# EAGLE design LDAQ-MOD-DAC4 (EAGLE 6.6.0)
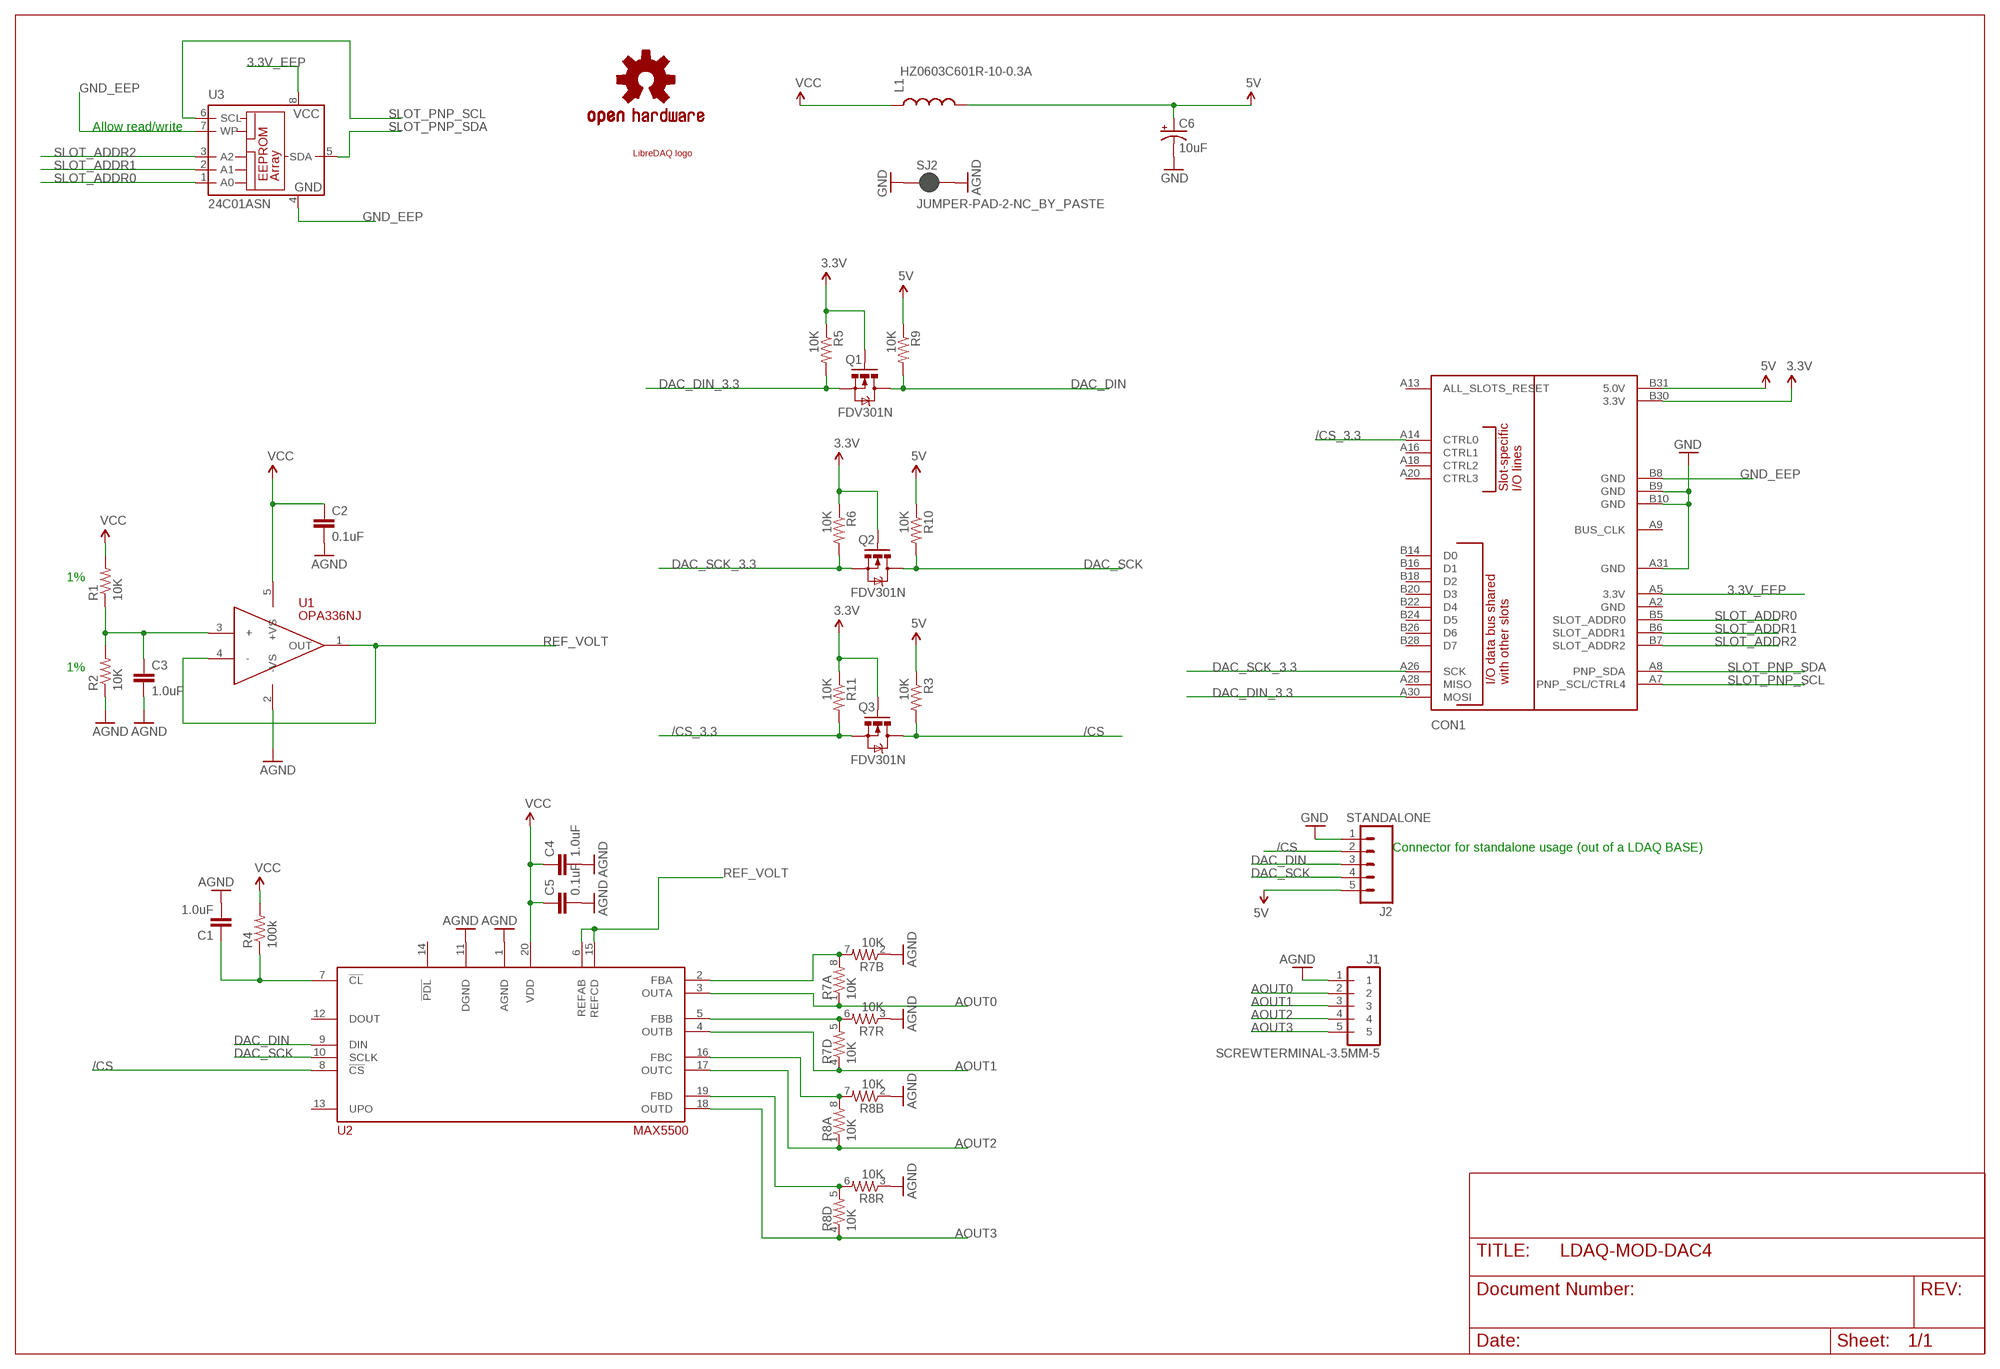
[diagram p0: schematic, sheet 1]

## Parts
C1  1.0uF  1.0UF-16V-10%(0603)  [0603-CAP]
C2  0.1uF  0.1UF-25V(+80/-20%)(0603)  [0603-CAP]
C3  1.0uF  1.0UF-16V-10%(0603)  [0603-CAP]
C4  1.0uF  1.0UF-16V-10%(0603)  [0603-CAP]
C5  0.1uF  0.1UF-25V(+80/-20%)(0603)  [0603-CAP]
C6  10uF  CAP_POL1206  [EIA3216]
CON1  BOARD  LIBREDAQ_DAUGHTER_BOARDPCIE-64-SIZE2-PADS  [PCI-E_64_EDGE_63X50_PADS-ONLY]
J1  SCREWTERMINAL-3.5MM-5  [SCREWTERMINAL-3.5MM-5]
J2  STANDALONE  M05LOCK  [1X05_LOCK]
L1  HZ0603C601R-10-0.3A  INDUCTOR0603  [0603]
LOGO1  OSHW-LOGOL  [OSHW-LOGO-L]
Q1  FDV301N  MOSFET-NCHANNELSMD  [SOT23-3]
Q2  FDV301N  MOSFET-NCHANNELSMD  [SOT23-3]
Q3  FDV301N  MOSFET-NCHANNELSMD  [SOT23-3]
R1  10K  10KOHM-1/10W-1%(0603)0603  [0603-RES]
R2  10K  10KOHM-1/10W-1%(0603)0603  [0603-RES]
R3  10K  RESISTOR0603-RES  [0603-RES]
R4  100k  100KOHM-1/10W-1%(0603)  [0603-RES]
R5  10K  RESISTOR0603-RES  [0603-RES]
R6  10K  RESISTOR0603-RES  [0603-RES]
R7  10K  RESISTOR-ARRAY0603-ARV  [0603-ARV]
R8  10K  RESISTOR-ARRAY0603-ARV  [0603-ARV]
R9  10K  RESISTOR0603-RES  [0603-RES]
R10  10K  RESISTOR0603-RES  [0603-RES]
R11  10K  RESISTOR0603-RES  [0603-RES]
SJ2  JUMPER-PAD-2-NC_BY_PASTE  [PAD-JUMPER-2-NC_BY_PASTE_YES_SILK]
U1  OPA336NJ  [SOT23-5]
U2  MAX5500  [SSOP20]
U3  24C01ASN  [SO-08]
U$1  LIBREDAQ_LOGO_MINILOGO_GENERIC  [LIBREDAQ_LOGO]

## Nets
3.3V: CON1.B30(3.3V) Q1.1(G) Q2.1(G) Q3.1(G) R5.1 R6.1 R11.1
3.3V_EEP: CON1.A5(3.3V) U3.8(VCC)
5V: C6.A(+) CON1.B31(5.0V) J2.5 L1.2 R3.1 R9.1 R10.1
/CS: J2.2 Q3.3(D) R3.2 U2.8(!CS)
/CS_3.3: CON1.A14(CTRL0) Q3.2(S) R11.2
AGND: C1.2 C2.2 C3.2 C4.2 C5.2 J1.1 R2.1 R7.2 R7.3 R8.2 R8.3 SJ2.2 U1.2(-VS) U2.1(AGND) U2.11(DGND)
AOUT0: J1.2 R7.1 U2.3(OUTA)
AOUT1: J1.3 R7.4 U2.4(OUTB)
AOUT2: J1.4 R8.1 U2.17(OUTC)
AOUT3: J1.5 R8.4 U2.18(OUTD)
DAC_DIN: J2.3 Q1.3(D) R9.2 U2.9(DIN)
DAC_DIN_3.3: CON1.A30(MOSI) Q1.2(S) R5.2
DAC_SCK: J2.4 Q2.3(D) R10.2 U2.10(SCLK)
DAC_SCK_3.3: CON1.A26(SCK) Q2.2(S) R6.2
GND: C6.C(-) CON1.A31(GND) CON1.B9(GND) CON1.B10(GND) J2.1 SJ2.1
GND_EEP: CON1.B8(GND) U3.4(GND) U3.7(WP)
N$1: R7.7 R7.8 U2.2(FBA)
N$2: C1.1 R4.1 U2.7(!CL)
N$3: R7.5 R7.6 U2.5(FBB)
N$5: R8.7 R8.8 U2.16(FBC)
N$6: R8.5 R8.6 U2.19(FBD)
N$10: C3.1 R1.1 R2.2 U1.3(+)
REF_VOLT: U1.1(OUT) U1.4(-) U2.6(REFAB) U2.15(REFCD)
SLOT_ADDR0: CON1.B5(SLOT_ADDR0) U3.1(A0)
SLOT_ADDR1: CON1.B6(SLOT_ADDR1) U3.2(A1)
SLOT_ADDR2: CON1.B7(SLOT_ADDR2) U3.3(A2)
SLOT_PNP_SCL: CON1.A7(PNP_SCL/CTRL4) U3.6(SCL)
SLOT_PNP_SDA: CON1.A8(PNP_SDA) U3.5(SDA)
VCC: C2.1 C4.1 C5.1 L1.1 R1.2 R4.2 U1.5(+VS) U2.20(VDD)
Unconnected: CON1.A2(GND) CON1.A9(BUS_CLK) CON1.A13(ALL_SLOTS_RESET) CON1.A16(CTRL1) CON1.A18(CTRL2) CON1.A20(CTRL3) CON1.A28(MISO) CON1.B14(D0) CON1.B16(D1) CON1.B18(D2) CON1.B20(D3) CON1.B22(D4) CON1.B24(D5) CON1.B26(D6) CON1.B28(D7) U2.12(DOUT) U2.13(UPO) U2.14(!PDL)

## Notes on the sheet
- Allow read/write
- 1%
- 1%
- Connector for standalone usage (out of a LDAQ BASE)

## Library data of the parts
C1 C3 C4 = SparkFun-Capacitors:1.0UF-16V-10%(0603): CAP-00868; PROD_ID: CAP-00868
C2 C5 = SparkFun-Capacitors:0.1UF-25V(+80/-20%)(0603): CAP-00810 Ceramic Standard decoupling cap; PROD_ID: CAP-00810
C6 = SparkFun-Capacitors:CAP_POL: Capacitor Polarized These are standard SMD and PTH capacitors. Normally 10uF, 47uF, and 100uF in electrolytic and tantalum varieties. Always verify the external diameter of the through hole cap, it varies with capacity, voltage, and manufacturer. The EIA devices should be standard.
CON1 = libredaq-comps:LIBREDAQ_DAUGHTER_BOARD: LibreDAQ Expansion board (PCI-E form)
J1 = libredaq-comps:SCREWTERMINAL-3.5MM-5
J2 = SparkFun-Connectors:M05: Header 5 Standard 5-pin 0.1" header. Use with straight break away headers (SKU : PRT-00116), right angle break away headers (PRT-00553), swiss pins (PRT-00743), machine pins (PRT-00117), and female headers (PRT-00115). Molex polarized connector foot print use with SKU : PRT-08230 with associated crimp pins and housings.
L1 = SparkFun-Passives:INDUCTOR: Inductors Basic Inductor/Choke - 0603 and 1206. Footprints are not proven and vary greatly between part numbers. SRN6045- 33uH, 20% 1.4A SDR0403-560KL - 56uH, 10%, 500mA RMS/740mA peak
LOGO1 = SparkFun-Aesthetics:OSHW-LOGO: Open Source Hardware Logo This logo indicates the piece of hardware it is found on incorporates a OSHW license and/or adheres to the definition of open source hardware found here: http://freedomdefined.org/OSHW
Q1-Q3 = SparkFun:MOSFET-NCHANNEL
R1 R2 = SparkFun-Resistors:10KOHM-1/10W-1%(0603): RES-00824; PROD_ID: RES-00824
R3 R5 R6 R9-R11 = SparkFun:RESISTOR: Resistor Basic schematic elements and footprints for 0603, 1206, and PTH resistors.
R4 = SparkFun-Resistors:100KOHM-1/10W-1%(0603): RES-07828; PROD_ID: RES-07828
R7 R8 = SparkFun-Resistors:RESISTOR-ARRAY: Array Chip Resistor Source: RS Component / Phycomp
SJ2 = SparkFun-Passives:JUMPER-PAD-2-NC_BY_PASTE
U1 = libredaq-comps:OPA336NJ
U2 = libredaq-comps:MAX5500: The MAX5500/MAX5501 integrate four low-power, 12-bit digital-to analog converters (DACs) and four precision output amplifiers in a small, 20-pin package.
U3 = libredaq-comps:24C*: Serial EEPROM 1 K/2 K/4 K; MPN: AT24C01BN-SH-B; OC_FARNELL: 1362638; OC_NEWARK: 50M3313
U$1 = libredaq-comps:LIBREDAQ_LOGO_MINI

## Board
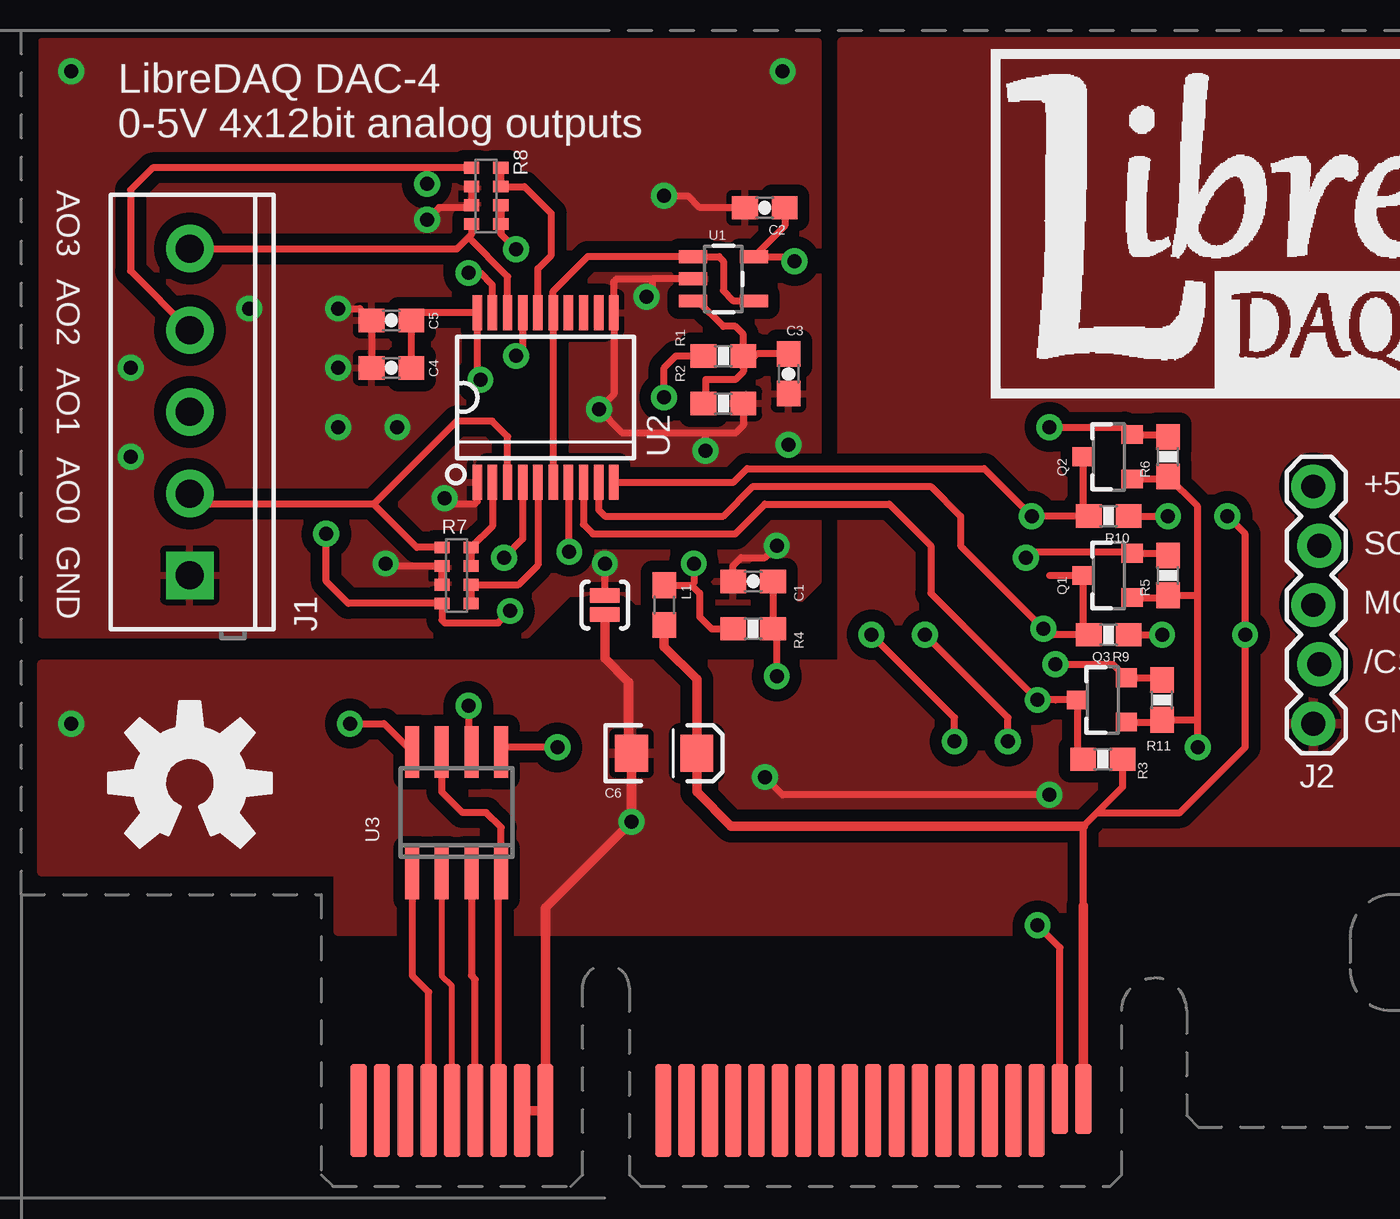
[diagram p1: board, top side]
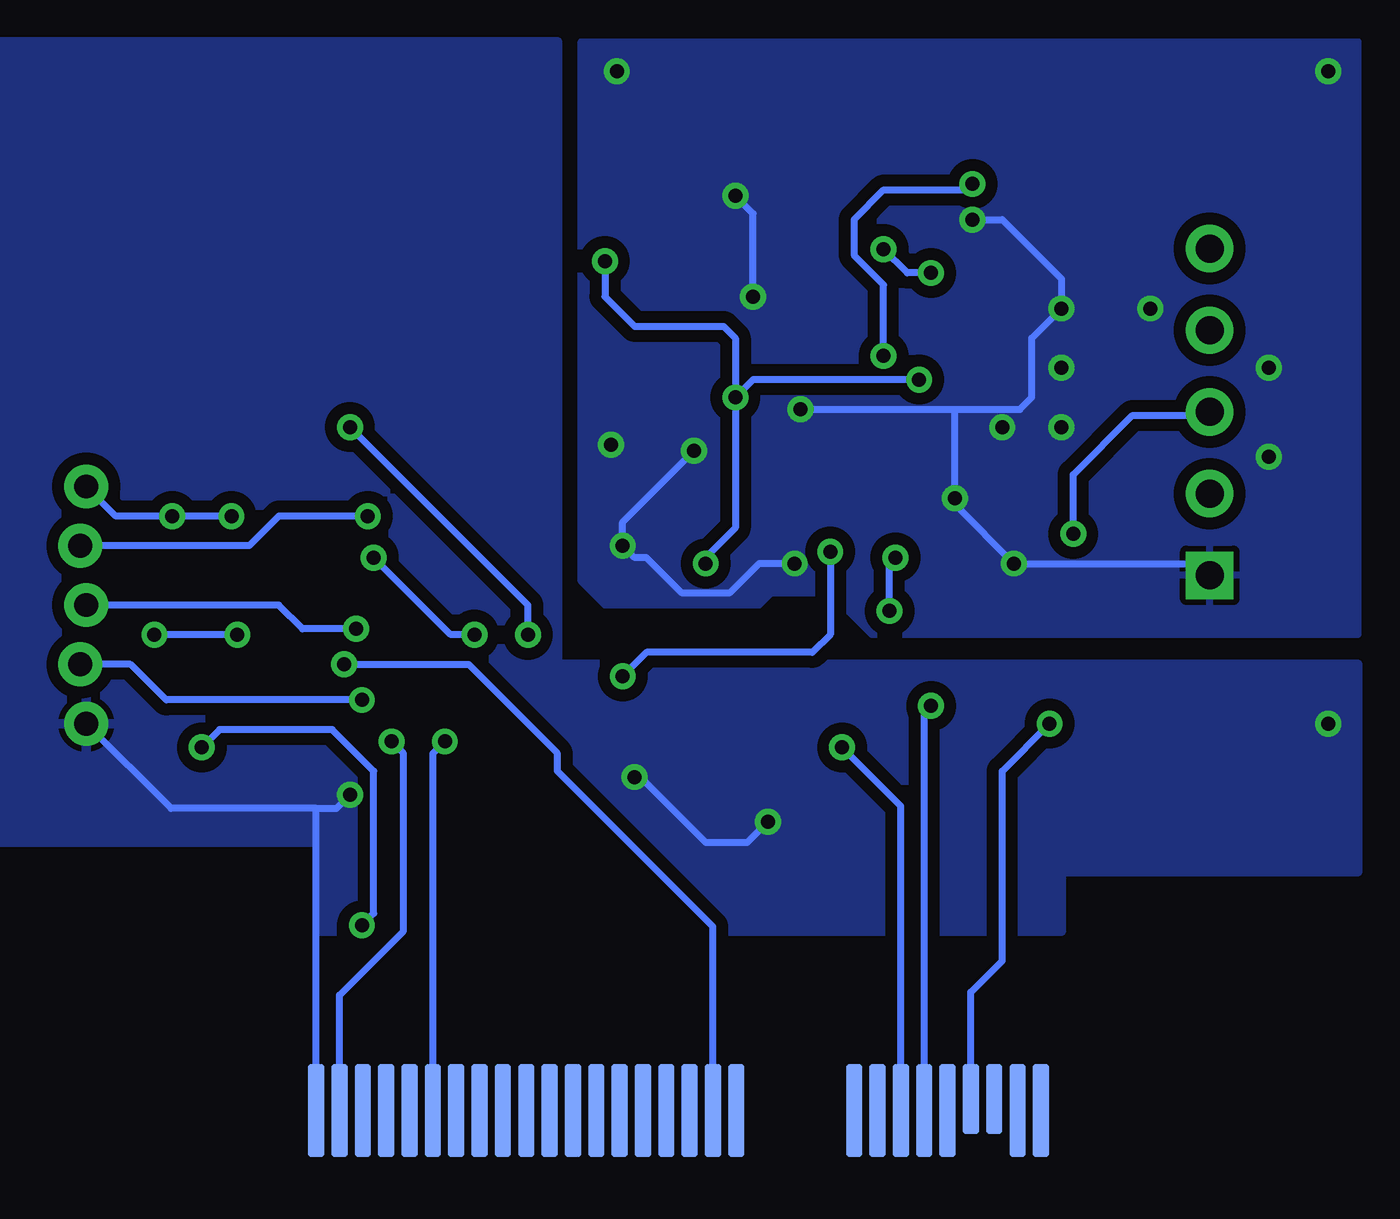
[diagram p2: board, bottom side, seen from below]

No outline drawn. Coordinates in mm, seen from the top.
Copper layers (1*16): Top 0.035mm / dielectric 1.5mm / Bottom 0.035mm
Design rules "LibreDAQ": minimum track width 8mil, minimum drill 20mil, track to track 8mil, track to pad 7mil, pad to pad 7mil, via to via 8mil, smd to smd 7mil, copper to edge 6mil, drill to drill 8mil, minimum pad ring 12mil, minimum via ring 10mil, stop-mask expansion 4mil, vias tented up to drill 25mil, thermal gap 10mil

### Footprints (pad centres in the part's own frame; a part is rotated, then mirrored left to right if it is on the bottom)
0603-CAP = smd 1.1 x 1: 1 -0.85,0; 2 0.85,0
EIA3216 = smd 1.4 x 1.6: A 1.4,0; C -1.4,0
PCI-E_64_EDGE_63X50_PADS-ONLY = smd 0.7 x 4 bottom: A2 -10.55,3.75; A3 -9.55,3.75; A6 -6.55,3.75; A7 -5.55,3.75; A8 -4.55,3.75; A9 -3.55,3.75; A10 -2.55,3.75; A13 2.5,3.75; A14 3.5,3.75; A15 4.5,3.75; A16 5.5,3.75; A17 6.5,3.75; A18 7.5,3.75; A19 8.5,3.75; A20 9.5,3.75; A21 10.5,3.75; A22 11.5,3.75; A23 12.5,3.75; A24 13.5,3.75; A25 14.5,3.75; A26 15.5,3.75; A27 16.5,3.75; A28 17.5,3.75; A29 18.5,3.75; A30 19.5,3.75; A31 20.5,3.75 | smd 0.7 x 3 bottom: A4 -8.55,4.25; A5 -7.55,4.25 | smd 0.7 x 4: B2 -10.55,3.75; B3 -9.55,3.75; B4 -8.55,3.75; B5 -7.55,3.75; B6 -6.55,3.75; B7 -5.55,3.75; B8 -4.55,3.75; B9 -3.55,3.75; B10 -2.55,3.75; B13 2.5,3.75; B14 3.5,3.75; B15 4.5,3.75; B16 5.5,3.75; B17 6.5,3.75; B18 7.5,3.75; B19 8.5,3.75; B20 9.5,3.75; B21 10.5,3.75; B22 11.5,3.75; B23 12.5,3.75; B24 13.5,3.75; B25 14.5,3.75; B26 15.5,3.75; B27 16.5,3.75; B28 17.5,3.75; B29 18.5,3.75 | smd 0.7 x 3: B30 19.5,4.25; B31 20.5,4.25
SCREWTERMINAL-3.5MM-5 = drill 1.2 pad 2.032 square: 1 0,0 | drill 1.2 pad 2.032: 2 3.5,0; 3 7,0; 4 10.5,0; 5 14,0
1X05_LOCK = drill 1.016 pad 1.88: 1 0,0.127; 2 2.54,-0.127; 3 5.08,0.127; 4 7.62,-0.127; 5 10.16,0.127
0603 = smd 1.1 x 1: 1 -0.85,0; 2 0.85,0
SOT23-3 = smd 0.8 x 0.9: 1 -0.95,-1; 2 0.95,-1; 3 0,1.1
0603-RES = smd 1.1 x 1: 1 -0.85,0; 2 0.85,0
0603-ARV = smd 0.5 x 0.65: 1 -1.2,-0.625; 2 -0.4,-0.625; 3 0.4,-0.625; 4 1.2,-0.625; 5 1.2,0.625; 6 0.4,0.625; 7 -0.4,0.625; 8 -1.2,0.625
PAD-JUMPER-2-NC_BY_PASTE_YES_SILK = smd 0.635 x 1.27: 1 -0.401,0; 2 0.413,0
SOT23-5 = smd 0.55 x 1.2: 1 -0.95,-1.3; 2 0,-1.3; 3 0.95,-1.3; 4 0.95,1.3; 5 -0.95,1.3
SSOP20 = smd 0.4 x 1.5: 1 -2.925,-3.625; 2 -2.275,-3.625; 3 -1.625,-3.625; 4 -0.975,-3.625; 5 -0.325,-3.625; 6 0.325,-3.625; 7 0.975,-3.625; 8 1.625,-3.625; 9 2.275,-3.625; 10 2.925,-3.625; 11 2.925,3.625; 12 2.275,3.625; 13 1.625,3.625; 14 0.975,3.625; 15 0.325,3.625; 16 -0.325,3.625; 17 -0.975,3.625; 18 -1.625,3.625; 19 -2.275,3.625; 20 -2.925,3.625
SO-08 = smd 0.6 x 2.2: 1 -1.905,-2.6; 2 -0.635,-2.6; 3 0.635,-2.6; 4 1.905,-2.6; 5 1.905,2.6; 6 0.635,2.6; 7 -0.635,2.6; 8 -1.905,2.6

### Placement (x,y rotation side)
C1  31.75,26.42 180 top
C2  32.26,42.42 180 top
C3  33.27,35.31 270 top
C4  16.26,35.56 180 top
C5  16.26,37.59 180 top
C6  27.94,19.05 0 top
CON1  25.4,0 0 top
J1  7.62,26.67 90 top
J2  55.88,20.32 90 top
L1  27.94,25.4 270 top
LOGO1  7.62,17.78 0 top
Q1  46.99,26.67 90 top
Q2  46.99,31.75 90 top
Q3  46.74,21.34 90 top
R1  30.48,36.07 180 top
R2  30.48,34.04 180 top
R3  46.74,18.8 180 top
R4  31.75,24.38 180 top
R5  49.53,26.67 90 top
R6  49.53,31.75 90 top
R7  19.05,26.67 270 top
R8  20.32,42.93 270 top
R9  46.99,24.13 180 top
R10  46.99,29.21 180 top
R11  49.28,21.34 90 top
SJ2  25.4,25.4 90 top
U1  30.48,39.37 270 top
U2  22.86,34.29 0 top
U3  19.05,16.51 0 top
U$1  41.91,34.29 0 top

### Tracks (layer width: path | path; a pad name or v marks a point on that pad's centre or on a via)
3.3V  (via drill 0.6)
  Top 0.305: Q3.1 49.18,20.39 R11.1 50.71,20.49 50.8,20.57 | Q1.1 49.43,25.72 R5.1 50.71,25.82 50.8,25.91 | Q2.1 49.43,30.8 R6.1 50.8,29.63 50.8,25.91 | CON1.B30 44.9,10.73 v43.94,11.68 | v50.8,19.3 50.8,20.57 | 50.8,20.57 50.8,25.91
  Bottom 0.305: v43.94,11.68 43.43,12.19 43.43,18.29 45.21,20.07 50.04,20.07 v50.8,19.3
3.3V_EEP  (via drill 0.6)
  Top 0.305: v14.48,20.32 15.94,20.32 U3.8
  Bottom 0.305: CON1.A5 17.85,8.82 16.51,10.16 16.51,18.29 v14.48,20.32
5V  (via drill 0.6)
  Top 0.305: 45.9,12.52 45.9,15.93 46.48,16.51 | 46.48,16.51 47.59,17.61 R3.1 47.5,18.71 | R10.1 v49.53,29.21 | 46.48,16.51 50.04,16.51 52.83,19.3 v52.83,24.13 52.83,28.45 v52.07,29.21 | R9.1 v49.28,24.13
  Top 0.406: CON1.B31 45.9,12.52 | L1.2 27.94,23.62 29.34,22.22 C6.A 29.34,17.4 30.81,15.93 45.9,15.93
  Bottom 0.305: v49.53,29.21 v52.07,29.21 54.48,29.21 J2.5 | v49.28,24.13 v52.83,24.13
/CS  (via drill 0.6)
  Top 0.305: U2.8 24.48,28.86 24.89,28.45 30.99,28.45 32.26,29.72 37.59,29.72 39.37,27.94 39.37,25.91 v43.94,21.34 Q3.3 | Q3.3 44.7,21.34 | Q3.3 45.64,19.05 R3.2
  Bottom 0.305: v43.94,21.34 52.32,21.34 53.85,22.86 J2.2
/CS_3.3  (via drill 0.6)
  Top 0.305: R11.2 49.18,22.29 Q3.2 47.16,22.86 v44.7,22.86
  Bottom 0.305: CON1.A14 28.9,11.63 35.56,18.29 35.56,19.05 39.37,22.86 v44.7,22.86
AGND  (via drill 0.6)
  Top 0.305: C4.2 C5.2 14.9,38.1 v13.97,38.1 | R7.3 R7.2 16.11,27.07 v16,27.18 | R8.3 R8.2 19.7,42.55 19.56,42.42 18.29,42.42 v17.78,41.91 | R2.1 31.33,33.11 30.99,32.77 29.72,32.77 | 29.72,32.77 26.16,32.77 v25.15,33.78 25.79,34.42 U2.11 25.79,39.25 25.91,39.37 27.43,39.37 | C2.2 29.46,42.42 28.96,42.93 v27.94,42.93 | U1.2 27.43,39.37 | 27.43,39.37 27.43,38.86 v27.18,38.61 | U2.1 19.93,29.84 19.81,29.72 18.8,29.72 v18.54,29.97 | C1.2 30.9,27.09 31.24,27.43 32.26,27.43 v32.77,27.94 | v29.72,32 29.72,32.77 | SJ2.2 v25.4,27.18
  Bottom 0.305: J1.1 8.13,27.18 v16,27.18 18.54,29.72 v18.54,29.97 18.54,33.78 | v25.15,33.78 18.54,33.78 | 18.54,33.78 15.75,33.78 15.24,34.29 15.24,36.83 v13.97,38.1 13.97,39.37 16.51,41.91 v17.78,41.91 | v27.18,38.61 27.18,42.16 v27.94,42.93 | v29.72,32 32.77,28.96 v32.77,27.94 32.26,27.43 31.75,27.43 30.23,25.91 28.19,25.91 26.92,27.18 v25.4,27.18
  other vias: 5.08,35.56 5.08,31.75 10.16,38.1 2.54,48.26 16.51,33.02 33.27,32.26 13.97,35.56 13.97,33.02 33.02,48.26
  pour Top (isolate 0.508): 1.27,49.53 1.27,24.13 22.1,24.13 23.88,25.91 26.42,25.91 26.92,25.4 33.53,25.4 34.54,26.42 34.54,49.53
  pour Bottom (isolate 0.508): 1.27,49.53 1.27,24.13 22.1,24.13 23.88,25.91 26.42,25.91 26.92,25.4 33.53,25.4 34.54,26.42 34.54,49.53
AOUT0
  Top 0.305: R7.1 17.34,27.87 15.49,29.72 | 15.49,29.72 8.07,29.72 J1.2 | U2.3 21.23,32.61 20.57,33.27 19.05,33.27 15.49,29.72
AOUT1  (via drill 0.6)
  Top 0.305: v13.46,28.45 13.46,26.42 14.41,25.47 R7.4 18.43,24.75 18.54,24.64 20.83,24.64 v21.34,25.15 | U2.4 21.89,28.23 v21.08,27.43
  Bottom 0.305: v13.46,28.45 13.46,30.99 10.92,33.53 7.76,33.53 J1.3 | v21.34,25.15 21.34,27.18 v21.08,27.43
AOUT2  (via drill 0.6)
  Top 0.305: R8.1 17.78,44.13 | 17.78,44.13 6.03,44.13 5.08,43.18 5.08,39.71 J1.4 | U2.17 21.89,36.36 v21.59,36.07 | v17.78,43.43 17.78,44.13
  Bottom 0.305: v21.59,36.07 21.59,39.12 22.86,40.39 22.86,41.91 21.59,43.18 18.03,43.18 v17.78,43.43
AOUT3
  Top 0.305: J1.5 7.65,40.64 19.05,40.64 19.56,41.15 | R8.4 19.7,41.28 19.56,41.15 | U2.18 21.23,39.47 19.56,41.15
DAC_DIN  (via drill 0.6)
  Top 0.305: U2.9 25.14,29.48 25.4,29.21 30.48,29.21 31.75,30.48 39.37,30.48 40.64,29.21 40.64,27.94 v44.2,24.38 | 44.45,26.67 Q1.3 45.89,24.38 R9.2 44.45,24.13 v44.2,24.38 | 43.94,24.13 v44.2,24.38
  Bottom 0.305: J2.3 47.5,25.4 46.48,24.38 v44.2,24.38
DAC_DIN_3.3  (via drill 0.6)
  Top 0.305: R5.2 49.43,27.62 Q1.2 47.92,27.69 43.69,27.69 v43.43,27.43 | v42.67,19.56 42.67,20.57 v39.12,24.13
  Bottom 0.305: CON1.A30 44.9,8.69 42.16,11.43 42.16,19.05 v42.67,19.56 | v39.12,24.13 40.13,24.13 v43.43,27.43
DAC_SCK  (via drill 0.6)
  Top 0.305: U2.10 30.92,30.66 31.5,31.24 41.66,31.24 v43.69,29.21 R10.2 45.89,29.46 Q2.3
  Bottom 0.305: v43.69,29.21 47.5,29.21 48.77,27.94 J2.4
DAC_SCK_3.3  (via drill 0.6)
  Top 0.305: R6.2 49.43,32.7 Q2.2 47.67,33.02 v44.45,33.02 | v40.39,19.56 40.39,20.57 v36.83,24.13
  Bottom 0.305: CON1.A26 40.9,19.04 v40.39,19.56 | v36.83,24.13 36.83,25.4 v44.45,33.02
GND  (via drill 0.6)
  Top 0.305: v44.45,17.27 33.02,17.27 v32.26,18.03
  Top 0.406: SJ2.1 25.4,23.11 26.42,22.1 26.42,19.17 C6.C v26.54,16.13 22.85,12.44 CON1.B10 CON1.B9
  Bottom 0.305: CON1.A31 45.9,16.69 | 45.9,16.69 45.03,16.69 v44.45,17.27 | v32.26,18.03 32,18.03 29.21,15.24 27.43,15.24 v26.54,16.13 | 45.9,16.69 52.12,16.69 J2.1
  other vias: 2.54,20.32
  pour Top (isolate 0.508): 35.56,49.53 62.23,49.53 62.23,15.24 45.72,15.24 45.72,11.43 13.97,11.43 13.97,13.97 1.27,13.97 1.27,22.86 35.56,22.86
  pour Bottom (isolate 0.508): 35.56,49.53 62.23,49.53 62.23,15.24 45.72,15.24 45.72,11.43 13.97,11.43 13.97,13.97 1.27,13.97 1.27,22.86 35.56,22.86
GND_EEP
  Top 0.254: 20.85,13.8 U3.4
  Top 0.305: CON1.B8 20.85,13.8 | U3.7 18.41,17.4 19.3,16.51 20.32,16.51 20.95,15.88 U3.4
N$1
  Top 0.305: R7.7 R7.8 20.59,28.78 U2.2
N$2  (via drill 0.6)
  Top 0.305: 32.77,26.58 C1.1 R4.1 32.77,24.22 v32.77,22.35 | U2.7 23.84,27.73 v23.88,27.69
  Bottom 0.305: v23.88,27.69 23.88,24.13 24.64,23.37 31.75,23.37 v32.77,22.35
N$3
  Top 0.305: R7.5 R7.6 21.7,26.27 22.54,27.11 U2.5
N$5
  Top 0.305: R8.8 R8.7 21.95,43.33 23.11,42.16 23.11,40.39 22.54,39.81 U2.16
N$6  (via drill 0.6)
  Top 0.305: R8.6 R8.5 20.95,41.28 v21.59,40.64 | v19.56,39.62 20.07,39.62 20.59,39.1 U2.19
  Bottom 0.305: v19.56,39.62 20.57,39.62 v21.59,40.64
N$10
  Top 0.305: U1.3 29.4,38.42 30.48,37.34 30.99,37.34 31.33,37 R1.1 31.33,35.56 | 31.33,35.56 31.33,35.39 30.99,35.05 29.72,35.05 29.72,34.12 R2.2 | C3.1 31.93,36.16 31.33,35.56
REF_VOLT
  Top 0.305: U2.6 U2.15 23.18,38.84 24.66,40.32 U1.1 30.29,40.32 30.48,40.13 30.48,38.86 30.92,38.42 U1.4
SLOT_ADDR0
  Top 0.305: U3.1 17.14,9.53 17.85,8.82 CON1.B5
SLOT_ADDR1
  Top 0.254: CON1.B6 18.85,9.09 18.41,9.53 U3.2
SLOT_ADDR2
  Top 0.305: CON1.B7 19.85,9.36 19.68,9.53 U3.3
SLOT_PNP_SCL  (via drill 0.6)
  Top 0.254: 19.56,19.24 U3.6
  Top 0.305: v19.56,21.08 19.56,19.24
  Bottom 0.305: CON1.A7 19.85,20.79 v19.56,21.08
SLOT_PNP_SDA  (via drill 0.6)
  Top 0.254: 21.15,19.3 U3.5
  Top 0.305: v23.37,19.3 21.15,19.3
  Bottom 0.305: CON1.A8 20.85,16.79 v23.37,19.3
VCC  (via drill 0.6)
  Top 0.305: L1.1 29.12,26.25 | 29.12,26.25 29.46,25.91 29.46,24.89 29.97,24.38 R4.2 | C4.1 C5.1 17.43,37.91 U2.20 19.93,35.18 v20.07,35.05 | C2.1 33.11,41.65 U1.5 33.34,40.32 v33.53,40.13 | v29.21,27.18 29.21,26.34 29.12,26.25 | v27.94,34.29 27.94,35.56 28.45,36.07 R1.2
  Bottom 0.305: v20.07,35.05 27.18,35.05 v27.94,34.29 | v27.94,34.29 27.94,28.7 29.21,27.43 v29.21,27.18 | v33.53,40.13 33.53,38.61 32.26,37.34 28.45,37.34 27.94,36.83 v27.94,34.29

### Text on the board
tPlace: LibreDAQ DAC-4 / 0-5V 4x12bit analog outputs | AO3 | AO2 | AO1 | AO0 | +5V | GND | SCK | MOSI | /CS | GND